# Altium project FEU-102-1_part3.PrjPcb
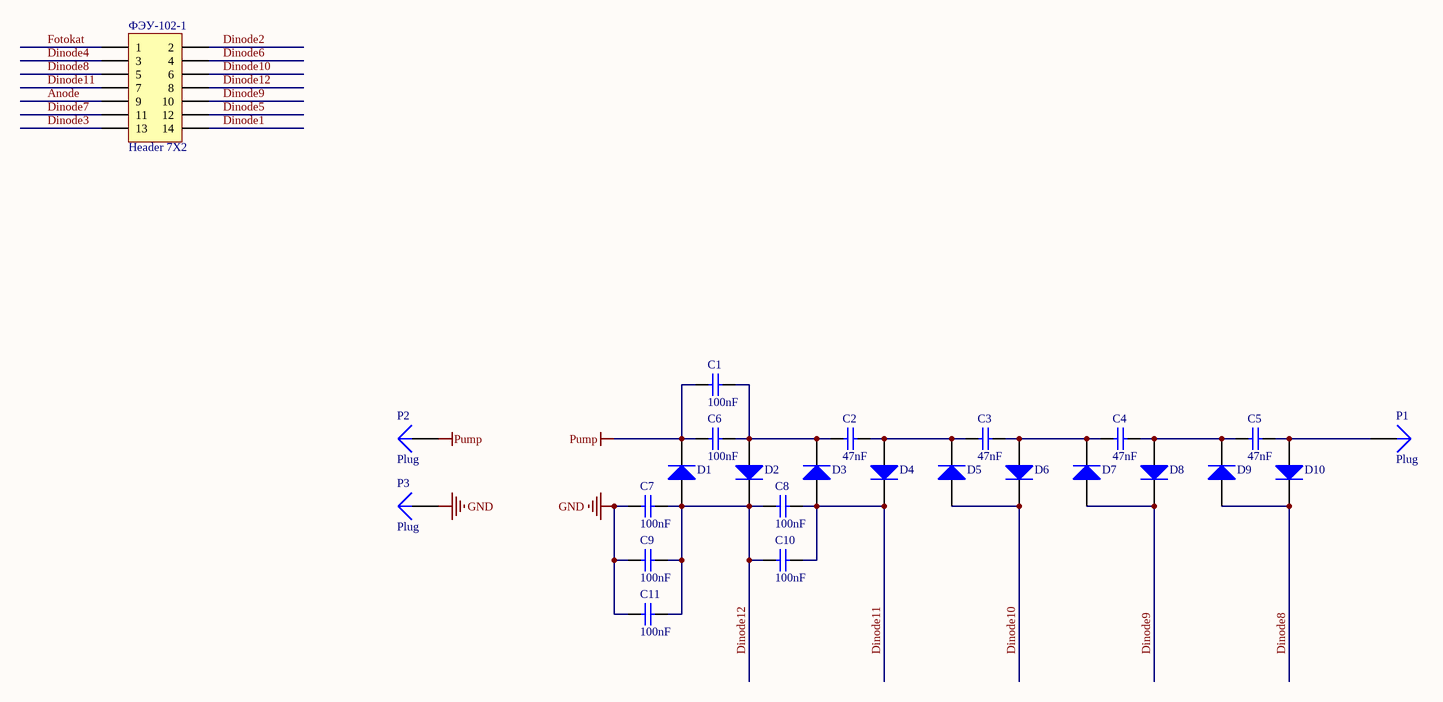
[diagram p0: FEU-102-1_part3.SchDoc]
1 sheet, 25 parts. Net scope: global (net labels, ports and power ports of the same name join across sheets).
Board file: FEU-102-1_part3.PcbDoc

## Sheet FEU-102-1_part3.SchDoc: Делитель ФЭУ-82
size A3; Address1: (с) Быканов Андрей; Address2: г.Тула 2016г.; Revision: 1

### Parts
C1  100nF  [C1206]
C2  47nF  [0805_CAP]
C3  47nF  [0805_CAP]
C4  47nF  [0805_CAP]
C5  47nF  [0805_CAP]
C6  100nF  [C1206]
C7  100nF  [C1206]
C8  100nF  [C1206]
C9  100nF  [C1206]
C10  100nF  [C1206]
C11  100nF  [C1206]
D1  (no value)  [DA2JF8100L]
D2  (no value)  [DA2JF8100L]
D3  (no value)  [DA2JF8100L]
D4  (no value)  [DA2JF8100L]
D5  (no value)  [DA2JF8100L]
D6  (no value)  [DA2JF8100L]
D7  (no value)  [DA2JF8100L]
D8  (no value)  [DA2JF8100L]
D9  (no value)  [DA2JF8100L]
D10  (no value)  [DA2JF8100L]
P1  Plug  [PIN1]
P2  Plug  [PIN1]
P3  Plug  [PIN1]
ФЭУ-102-1  Header 7X2  [ФЭУ-102]

### Nets
GND: C7.2 C9.2 C11.2 P3.1
Pump: C1.2 C6.2 D1.2(K) P2.1
Anode: ФЭУ-102-1.9
Dinode1: ФЭУ-102-1.14
Dinode2: ФЭУ-102-1.2
Dinode3: ФЭУ-102-1.13
Dinode4: ФЭУ-102-1.3
Dinode5: ФЭУ-102-1.12
Dinode6: ФЭУ-102-1.4
Dinode7: ФЭУ-102-1.11
Dinode8: D9.1(A) D10.2(K) ФЭУ-102-1.5
Dinode9: D7.1(A) D8.2(K) ФЭУ-102-1.10
Dinode10: D5.1(A) D6.2(K) ФЭУ-102-1.6
Dinode11: C8.1 C10.1 D3.1(A) D4.2(K) ФЭУ-102-1.7
Dinode12: C7.1 C8.2 C9.1 C10.2 C11.1 D1.1(A) D2.2(K) ФЭУ-102-1.8
Fotokat: ФЭУ-102-1.1
NetC1_1: C1.1 C2.2 C6.1 D2.1(A) D3.2(K)
NetC2_1: C2.1 C3.2 D4.1(A) D5.2(K)
NetC3_1: C3.1 C4.2 D6.1(A) D7.2(K)
NetC4_1: C4.1 C5.2 D8.1(A) D9.2(K)
NetC5_1: C5.1 D10.1(A) P1.1

### Notes on the sheet
- Title
- Size:
- Date:
- A3
- Number:
- Time:
- Revision:
- Sheet
- of
- File:

### Library data of the parts
C1 C6-C11 = Cap Semi: Capacitor (Semiconductor SIM Model); Order: CGA5L4X7T2W104K; Published: 8-Jun-2000; LatestRevisionDate: 29-May-2009; LatestRevisionNote: IPC-7351 Footprint Added.; PackageReference: C1206; Publisher: Altium Limited; PackageDescription: Chip Capacitor; Value: 100nF
C2-C5 = Cap Semi: Capacitor (Semiconductor SIM Model); Order: CGA4J4X7T2W473M/SOFT; Published: 8-Jun-2000; LatestRevisionDate: 29-May-2009; LatestRevisionNote: IPC-7351 Footprint Added.; PackageReference: C1206; Publisher: Altium Limited; PackageDescription: Chip Capacitor; Value: 47nF
D1-D10 = Diode: Default Diode; Value: DA2JF8100L; Published: 8-Jun-2000; LatestRevisionDate: 17-Jul-2002; LatestRevisionNote: Re-released for DXP Platform.; PackageVersion: Sep-1996; PackageReference: SMC; Publisher: Altium Limited; PackageDescription: DO-214-AB/SMC; 2 C-Bend Leads; Body 7.9 x 5.9 mm, inc. leads (LxW); Code_JEDEC: DO-214-AB; Order: DA2JF8100L
ФЭУ-102-1 = Header 7X2: Header, 7-Pin, Dual row; LatestRevisionDate: 17-Jul-2002; LatestRevisionNote: Re-released for DXP Platform.; Publisher: Altium Limited
P1-P3 = Plug: LatestRevisionDate: 17-Jul-2002; LatestRevisionNote: Re-released for DXP Platform.; Publisher: Altium Limited